# EAGLE schematic LM2596_MainBoard_V0.1 (EAGLE 9.3.0)
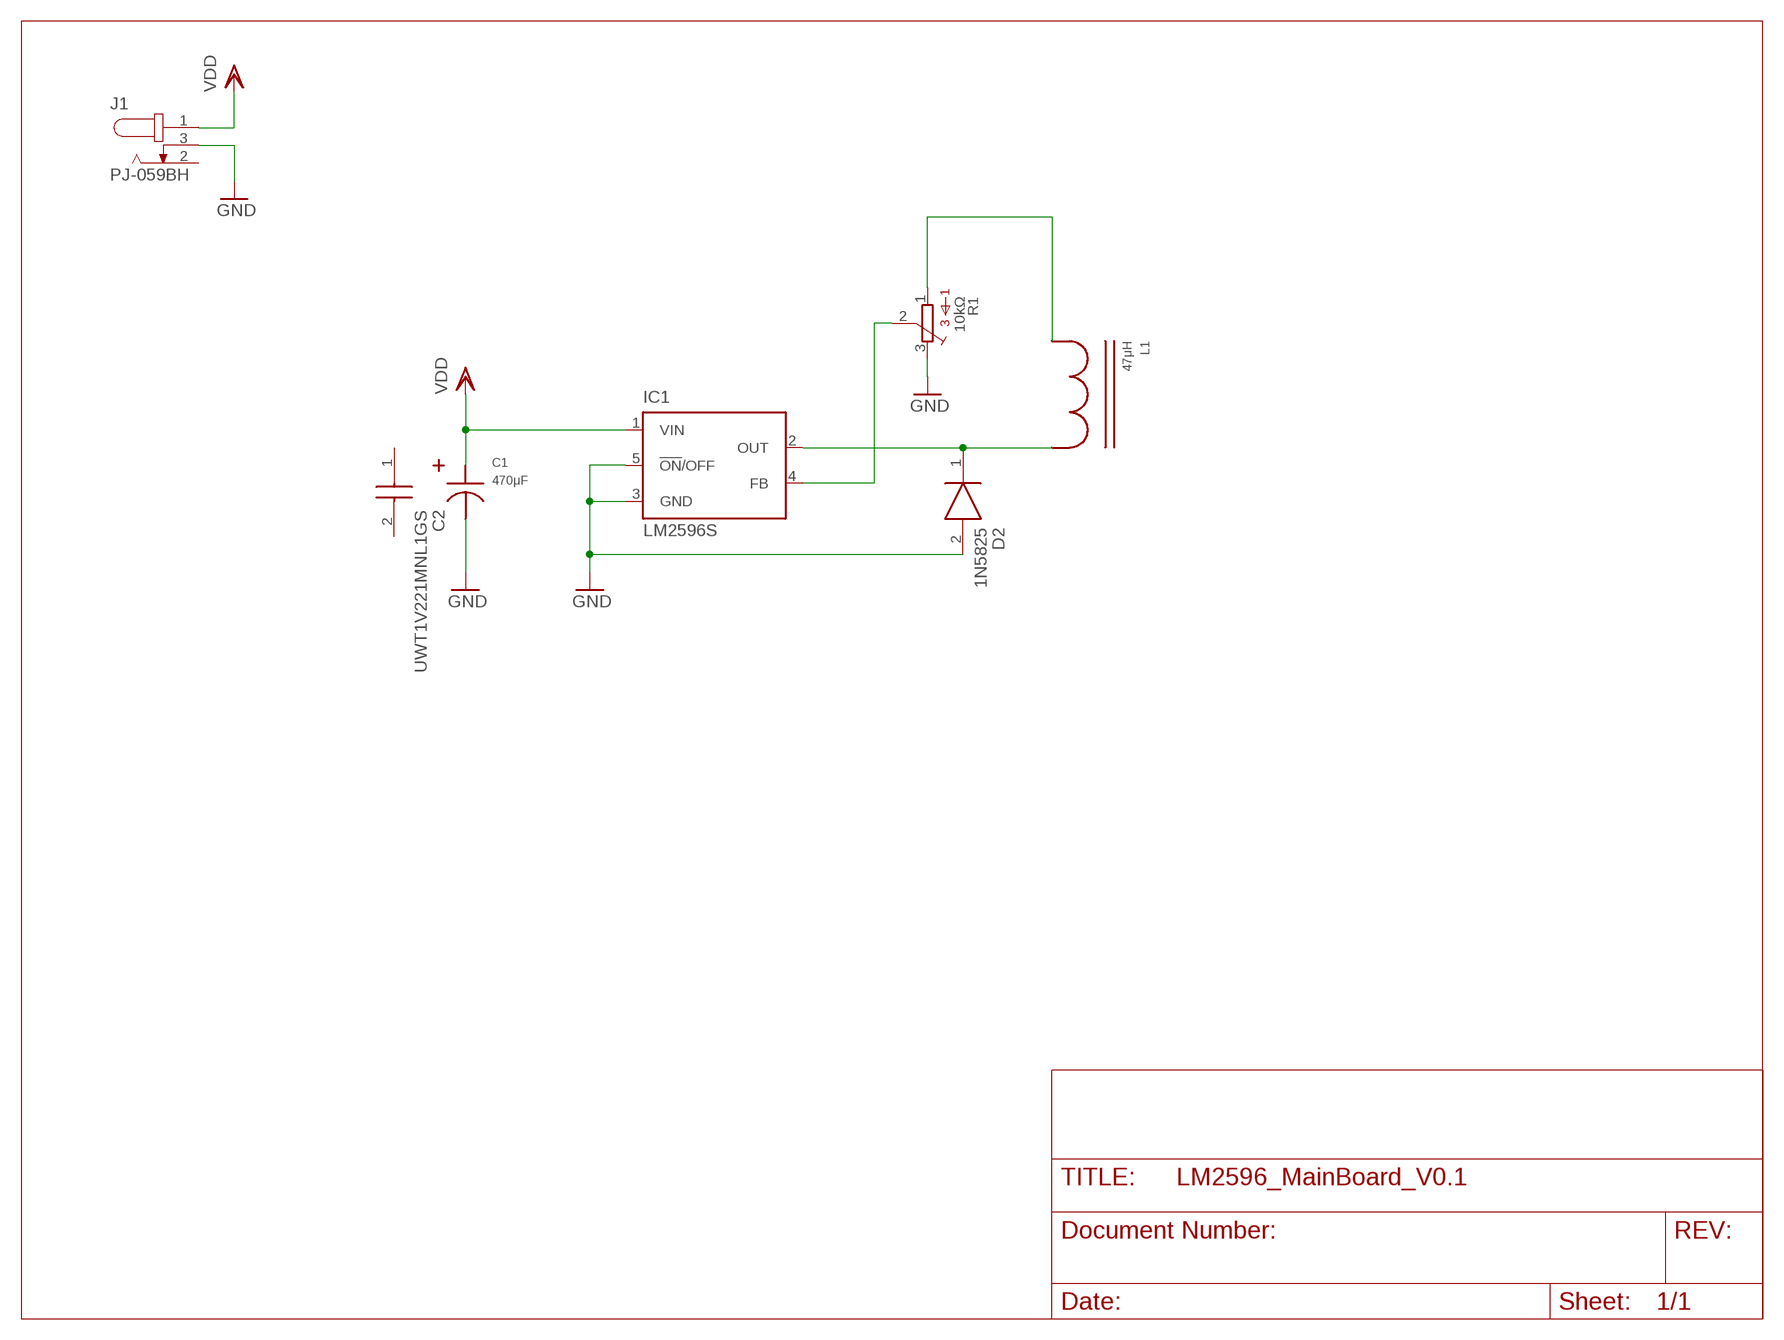
[diagram p0: schematic, sheet 1]

## Parts
C1  470μF  VE-471M1HTR-1316  [LELON_SMD_CAP_12P5]
C2  UWT1V221MNL1GS  [UWT(8X10)]
D2  1N5825  [DIOAD4191W142L1143D762]
IC1  LM2596S  [TO263-5]
J1  PJ-059BH  [CUI_PJ-059BH]
L1  47μH  HA78-60470LFTR13  [HA78-60]
R1  10kΩ  3386-W  [3386W]

## Nets
GND: C1.N D2.2(A) IC1.3(GND) IC1.5(!ON!/OFF) J1.3 R1.3
N$1: D2.1(K) IC1.2(OUT) L1.P$2
N$2: IC1.4(FB) R1.2
N$4: L1.P$1 R1.1
VDD: C1.P IC1.1(VIN) J1.1
Unconnected: C2.1(-) C2.2(+) J1.2

## Library data of the parts
C1 = EuroRack_PS_LM2596:VE-471M1HTR-1316
C2 = EuroRack_PS_LM2596:UWT1V221MNL1GS: Al Cap WT series SMT 220uF 35V Nichicon 220uF 35 V Aluminium Electrolytic Capacitor, WT Series 1000h 8 (Dia.) x 10mm Source: Datasheet <https://componentsearchengine.com/Datasheets/1/UWT1V221MNL1GS.pdf>; DESCRIPTION: Al Cap WT series SMT 220uF 35V Nichicon 220uF 35 V Aluminium Electrolytic Capacitor, WT Series 1000h 8 (Dia.) x 10mm; HEIGHT: mm; MANUFACTURER_NAME: Nichicon; MANUFACTURER_PART_NUMBER: UWT1V221MNL1GS; MOUSER_PART_NUMBER: 647-UWT1V221MNL1S
D2 = EuroRack_PS_LM2596:1N5825: Schottky Diodes & Rectifiers Schottky Rectifier, 5A, 350v, 1470pF Source: Datasheet <https://componentsearchengine.com/Datasheets/1/1N5825.pdf>; DESCRIPTION: Schottky Diodes & Rectifiers Schottky Rectifier, 5A, 350v, 1470pF; HEIGHT: mm; MANUFACTURER_NAME: Microsemi Corporation; MANUFACTURER_PART_NUMBER: 1N5825; MOUSER_PART_NUMBER: 494-1N5825
IC1 = EuroRack_PS_LM2596:LM2596: SIMPLE SWITCHER® Power Converter 150 kHz 3A Step-Down Voltage Regulator Source: http://www.national.com/ds/LM/LM2596.pdf; MF: NATIONAL SEMICONDUCTOR; MPN: LM2596S-ADJ/NOPB; OC_FARNELL: 9494367; OC_NEWARK: 41K3842
J1 = EuroRack_PS_LM2596:PJ-059BH: 2.5 mm Center Pin, 5.0 A, Right Angle, Through Hole, Locking Type, Tapered Pins, Dc Power Jack Connector; MANUFACTURER: CUI INC; PARTREV: 1.02; STANDARD: Manufacturer recommendations
L1 = EuroRack_PS_LM2596:HA78-60470LFTR13
R1 = EuroRack_PS_LM2596:3386-: 3386 Series 3/8" Square Trimmer